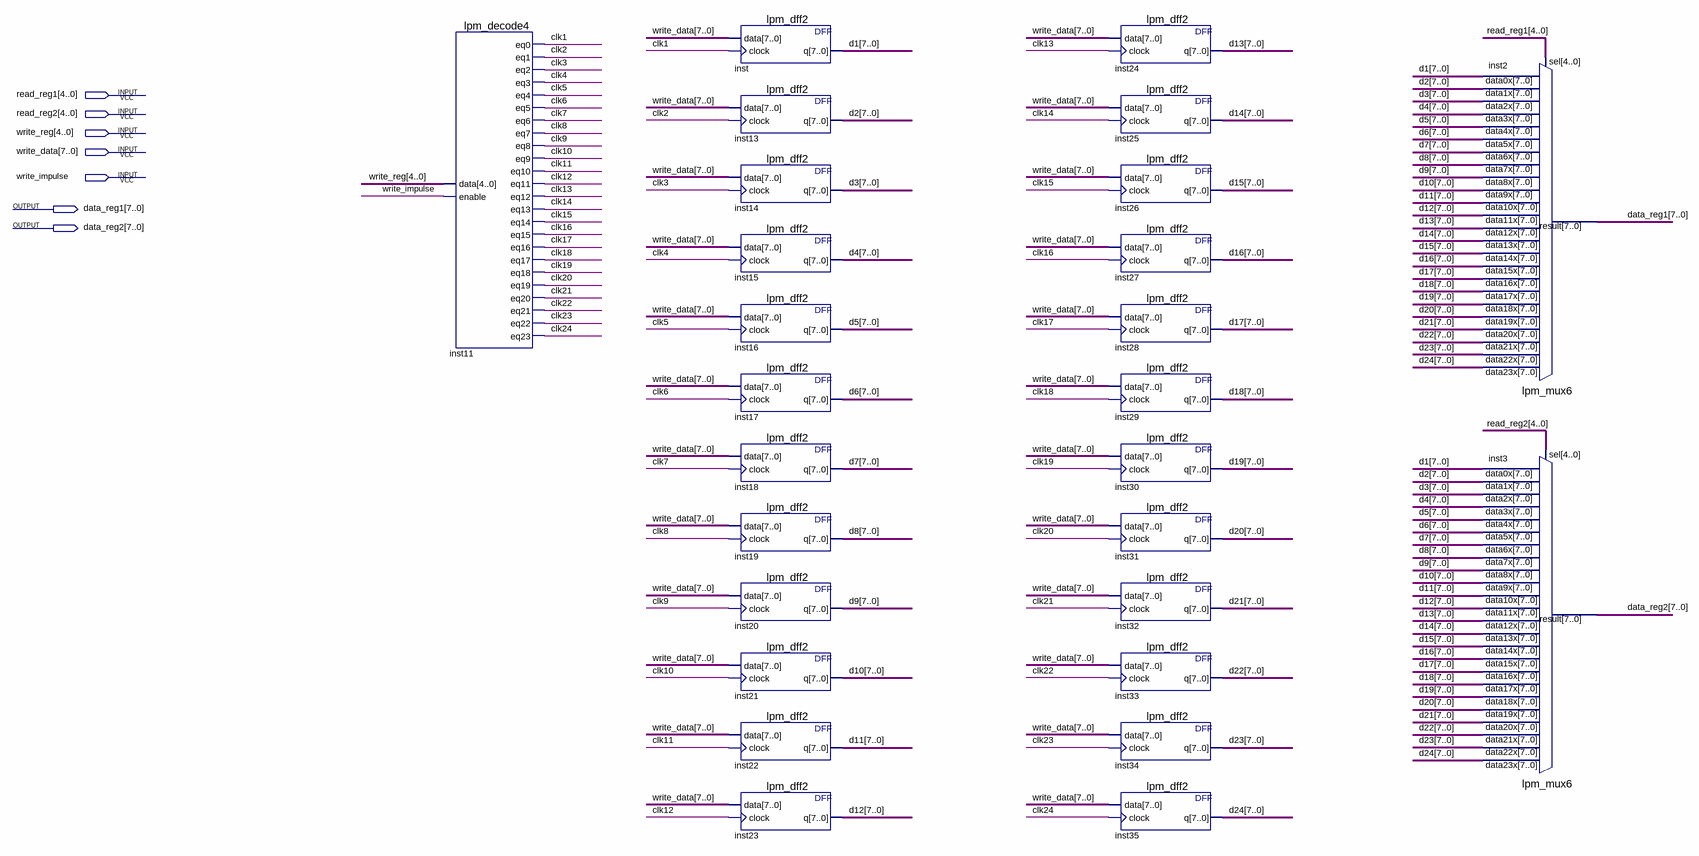
[diagram p0: schematic sheet]
// Quartus schematic RegistersMemory.bdf as structural Verilog: 27 symbols, 7 pins
module RegistersMemory (
  input  [4:0] read_reg1,
  input  [4:0] read_reg2,
  input  [4:0] write_reg,
  input  [7:0] write_data,
  input  write_impulse,
  output [7:0] data_reg1,
  output [7:0] data_reg2
);

  wire clk1, clk2, clk3, clk4, clk5, clk6, clk7, clk8, clk9, clk10, clk11, clk12, clk13, clk14, clk15, clk16,
       clk17, clk18, clk19, clk20, clk21, clk22, clk23, clk24;
  wire [7:0] d1, d2, d3, d4, d5, d6, d7, d8, d9, d10, d11, d12, d13, d14, d15, d16, d17, d18, d19, d20, d21,
       d22, d23, d24;

  lpm_decode4 inst11 (
    .data(write_reg), .enable(write_impulse), .eq0(clk1), .eq1(clk2), .eq2(clk3), .eq3(clk4), .eq4(clk5),
    .eq5(clk6), .eq6(clk7), .eq7(clk8), .eq8(clk9), .eq9(clk10), .eq10(clk11), .eq11(clk12), .eq12(clk13),
    .eq13(clk14), .eq14(clk15), .eq15(clk16), .eq16(clk17), .eq17(clk18), .eq18(clk19), .eq19(clk20),
    .eq20(clk21), .eq21(clk22), .eq22(clk23), .eq23(clk24));
  lpm_dff2 inst (.data(write_data), .clock(clk1), .q(d1));
  lpm_dff2 inst13 (.data(write_data), .clock(clk2), .q(d2));
  lpm_dff2 inst14 (.data(write_data), .clock(clk3), .q(d3));
  lpm_dff2 inst15 (.data(write_data), .clock(clk4), .q(d4));
  lpm_dff2 inst16 (.data(write_data), .clock(clk5), .q(d5));
  lpm_dff2 inst17 (.data(write_data), .clock(clk6), .q(d6));
  lpm_dff2 inst18 (.data(write_data), .clock(clk7), .q(d7));
  lpm_dff2 inst19 (.data(write_data), .clock(clk8), .q(d8));
  lpm_dff2 inst20 (.data(write_data), .clock(clk9), .q(d9));
  lpm_dff2 inst21 (.data(write_data), .clock(clk10), .q(d10));
  lpm_dff2 inst22 (.data(write_data), .clock(clk11), .q(d11));
  lpm_dff2 inst23 (.data(write_data), .clock(clk12), .q(d12));
  lpm_dff2 inst24 (.data(write_data), .clock(clk13), .q(d13));
  lpm_dff2 inst25 (.data(write_data), .clock(clk14), .q(d14));
  lpm_dff2 inst26 (.data(write_data), .clock(clk15), .q(d15));
  lpm_dff2 inst27 (.data(write_data), .clock(clk16), .q(d16));
  lpm_dff2 inst28 (.data(write_data), .clock(clk17), .q(d17));
  lpm_dff2 inst29 (.data(write_data), .clock(clk18), .q(d18));
  lpm_dff2 inst30 (.data(write_data), .clock(clk19), .q(d19));
  lpm_dff2 inst31 (.data(write_data), .clock(clk20), .q(d20));
  lpm_dff2 inst32 (.data(write_data), .clock(clk21), .q(d21));
  lpm_dff2 inst33 (.data(write_data), .clock(clk22), .q(d22));
  lpm_dff2 inst34 (.data(write_data), .clock(clk23), .q(d23));
  lpm_dff2 inst35 (.data(write_data), .clock(clk24), .q(d24));
  lpm_mux6 inst2 (
    .data23x(d24), .data22x(d23), .data21x(d22), .data20x(d21), .data19x(d20), .data18x(d19), .data17x(d18),
    .data16x(d17), .data15x(d16), .data14x(d15), .data13x(d14), .data12x(d13), .data11x(d12), .data10x(d11),
    .data9x(d10), .data8x(d9), .data7x(d8), .data6x(d7), .data5x(d6), .data4x(d5), .data3x(d4), .data2x(d3),
    .data1x(d2), .data0x(d1), .sel(read_reg1), .result(data_reg1));
  lpm_mux6 inst3 (
    .data23x(d24), .data22x(d23), .data21x(d22), .data20x(d21), .data19x(d20), .data18x(d19), .data17x(d18),
    .data16x(d17), .data15x(d16), .data14x(d15), .data13x(d14), .data12x(d13), .data11x(d12), .data10x(d11),
    .data9x(d10), .data8x(d9), .data7x(d8), .data6x(d7), .data5x(d6), .data4x(d5), .data3x(d4), .data2x(d3),
    .data1x(d2), .data0x(d1), .sel(read_reg2), .result(data_reg2));
endmodule
